# EAGLE design rgb-rotary-encoder-breakout-mk-1.0 (EAGLE 6.5.0)
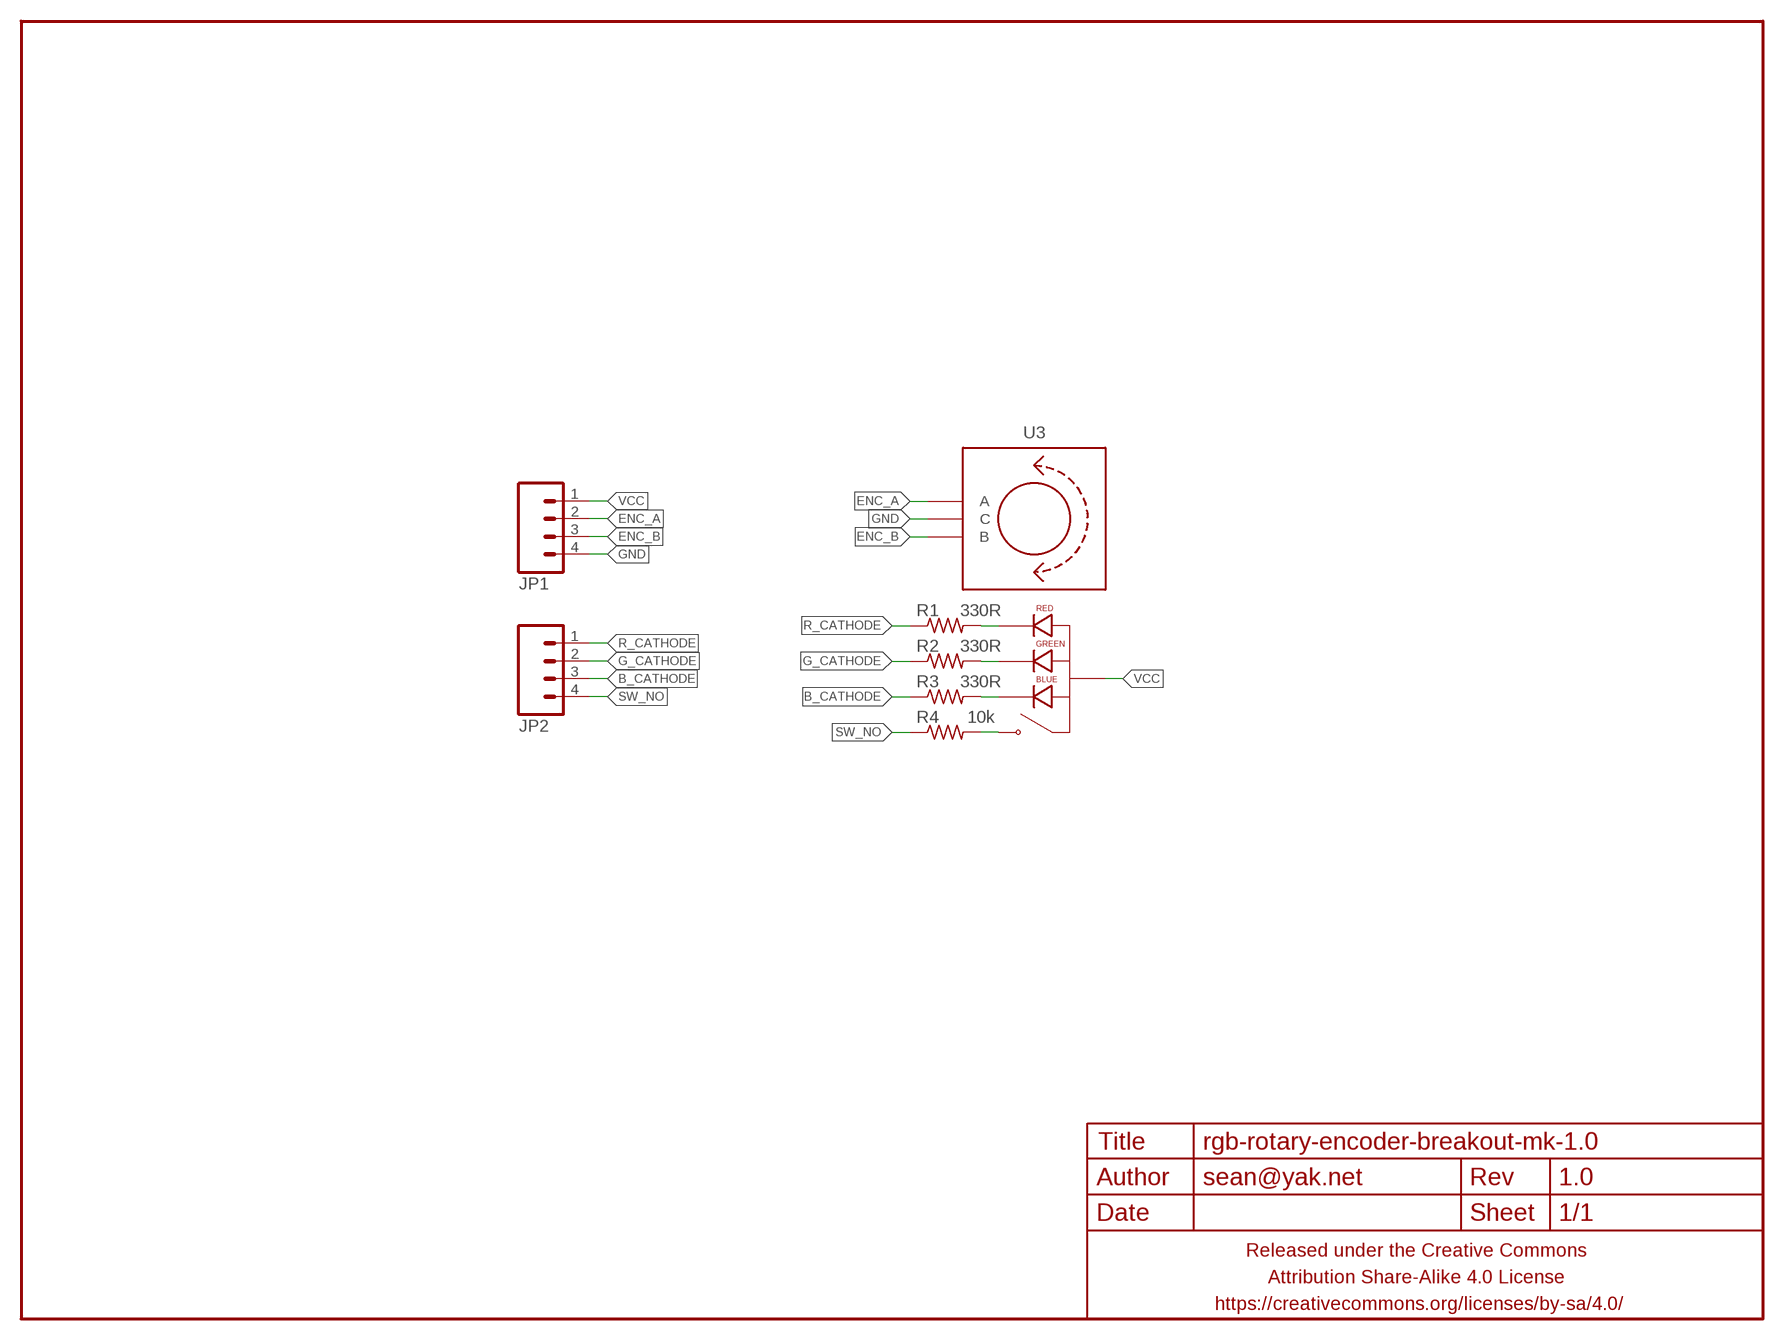
[diagram p0: schematic, sheet 1]

## Parts
FRAME1  FRAME-LETTERNO_PACKAGE  [DUMMY]
JP1  M04PTH  [1X04-PTH-VERT]
JP2  M04PTH  [1X04-PTH-VERT]
R1  330R  RESISTORPTH-AXIAL-7.62MM  [RESISTOR-AXIAL-PTH-7.62MM]
R2  330R  RESISTORPTH-AXIAL-7.62MM  [RESISTOR-AXIAL-PTH-7.62MM]
R3  330R  RESISTORPTH-AXIAL-7.62MM  [RESISTOR-AXIAL-PTH-7.62MM]
R4  10k  RESISTORPTH-AXIAL-7.62MM  [RESISTOR-AXIAL-PTH-7.62MM]
U3  ROTARY_ENCODER_SWITCH_RGBNO_LAB_TOP  [ROTARY_ENCODER_SWITCH_RGB_NO_LAB_TOP]

## Nets
B_CATHODE: JP2.3 R3.P$1
ENC_A: JP1.2 U3.ENC_A(A)
ENC_B: JP1.3 U3.ENC_B(B)
G_CATHODE: JP2.2 R2.P$1
GND: JP1.4 U3.ENC_COM(C)
N$1: R4.P$2 U3.SW_NO(NO)
N$2: R1.P$2 U3.LED_R(RED_CATHODE)
N$3: R2.P$2 U3.LED_G(GREEN_CATHODE)
N$4: R3.P$2 U3.LED_B(BLUE_CATHODE)
R_CATHODE: JP2.1 R1.P$1
SW_NO: JP2.4 R4.P$1
VCC: JP1.1 U3.LED_SW_COM(ANODE)

## Library data of the parts
FRAME1 = A_butts:FRAME-LETTER: Schematic Frame Standard 8.5x11 US Letter frame; DESIGNER: sean@yak.net; VERSION: 1.0
JP1 JP2 = A_butts:M04: Header 4 Standard 4-pin 0.1" header. Use with straight break away headers (SKU : PRT-00116), right angle break away headers (PRT-00553), swiss pins (PRT-00743), machine pins (PRT-00117), and female headers (PRT-00115). Molex polarized connector foot print use with SKU : PRT-08231 with associated crimp pins and housings. 1MM SMD Version SKU: PRT-10208
R1-R4 = A_butts:RESISTOR: RESISTOR, American symbol
U3 = A_butts:ROTARY_ENCODER_SWITCH_RGB

## Board
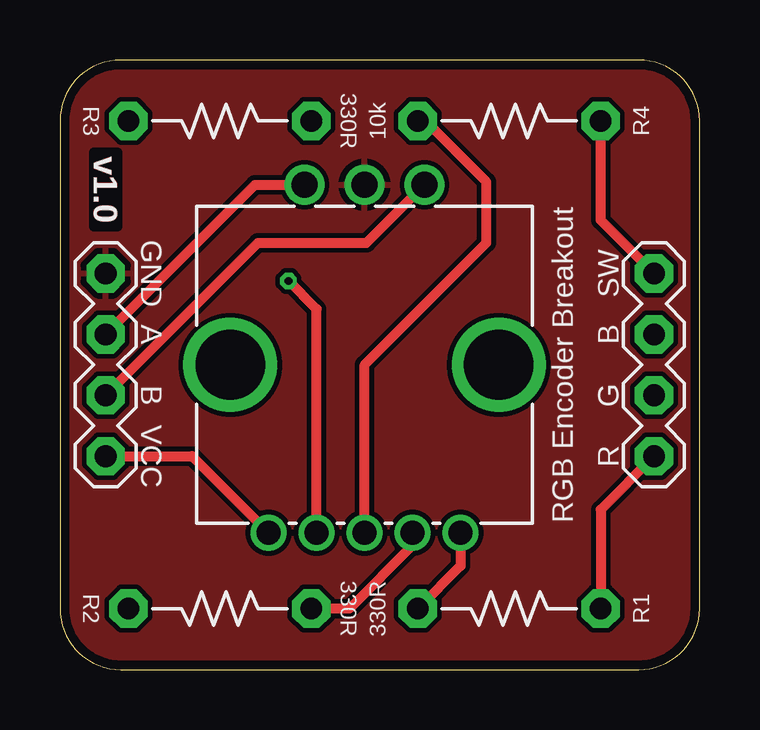
[diagram p1: board, top side]
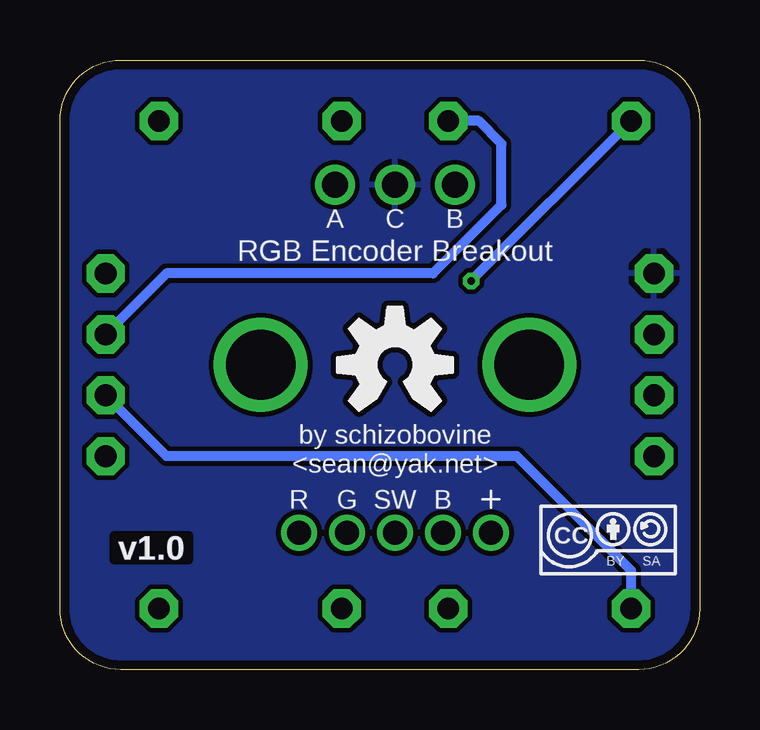
[diagram p2: board, bottom side, seen from below]

Size 26.67 x 25.4 mm. Coordinates in mm from the lower left corner, seen from the top.
Outline: 0,22.86 0,2.54 arc90 2.54,0 24.13,0 arc90 26.67,2.54 26.67,22.86 arc90 24.13,25.4 2.54,25.4 arc90 0,22.86
Copper layers (1*16): Top 0.0356mm / dielectric 1.5011mm / Bottom 0.0356mm
Design rules "LaenPCBOrder2": minimum track width 6mil, minimum drill 13mil, track to track 6mil, track to pad 6mil, pad to pad 6mil, via to via 6mil, smd to smd 6mil, copper to edge 15mil, drill to drill 6mil, minimum pad ring 7mil, minimum via ring 7mil, stop-mask expansion 3mil, vias tented up to drill 20mil, thermal gap 10mil

### Footprints (pad centres in the part's own frame; a part is rotated, then mirrored left to right if it is on the bottom)
1X04-PTH-VERT = drill 0.9 pad 1.6 octagon: 1 0,0; 2 2.54,0; 3 5.08,0; 4 7.62,0
RESISTOR-AXIAL-PTH-7.62MM = drill 0.9 pad 1.6 octagon: P$1 -3.81,0; P$2 3.81,0
ROTARY_ENCODER_SWITCH_RGB_NO_LAB_TOP = drill 1.1: ENC_A -2.5,-7.5; ENC_B 2.5,-7.5; ENC_COM 0,-7.5 | drill 1: LED_B 2,7; LED_G -2,7; LED_R -4,7; LED_SW_COM 4,7; SW_NO 0,7 | drill 2.9: P$1 -5.6,0; P$2 5.6,0

### Placement (x,y rotation side)
FRAME1  0,0 0 top
JP1  1.91,8.89 90 top
JP2  24.77,8.89 90 top
R1  18.73,2.54 180 top
R2  6.67,2.54 0 top
R3  6.67,22.86 180 top
R4  18.73,22.86 180 top
U3  12.7,12.7 180 top
U$1  [OSHWLOGO_5MM_METAL]  12.7,12.7 0 bottom
U$2  [CC-BY-SA-4.0-NO-URL]  3.81,5.4 0 bottom

### Tracks (layer width: path | path; a pad name or v marks a point on that pad's centre or on a via)
B_CATHODE
  Bottom 0.406: JP2.3 22.23,16.51 11.11,16.51 8.26,19.37 8.26,21.91 9.21,22.86 R3.P$1
ENC_A
  Top 0.406: JP1.2 8.26,17.78 12.78,17.78 U3.ENC_A
ENC_B
  Top 0.406: JP1.3 8.13,20.2 U3.ENC_B
G_CATHODE
  Bottom 0.406: R2.P$1 2.86,4.13 7.62,8.89 22.23,8.89 JP2.2
GND
  pour Bottom (isolate 0.2): 24.13,0 2.54,0 arc-90 0,2.54 0,22.86 arc-90 2.54,25.4 24.13,25.4 arc-90 26.67,22.86 26.67,2.54 arc-90
  pour Top (isolate 0.2): 24.13,0 2.54,0 arc-90 0,2.54 0,22.86 arc-90 2.54,25.4 24.13,25.4 arc-90 26.67,22.86 26.67,2.54 arc-90
N$1
  Top 0.406: U3.SW_NO 12.7,12.7 17.78,17.78 17.78,20.32 15.24,22.86 R4.P$2
N$2
  Top 0.406: U3.LED_R 16.7,4.32 R1.P$2
N$3
  Top 0.406: U3.LED_G 14.7,5.17 12.06,2.54 R2.P$2
N$4  (via drill 0.33)
  Top 0.406: U3.LED_B 10.7,15.02 v9.53,16.19
  Bottom 0.406: v9.53,16.19 R3.P$2
R_CATHODE
  Top 0.406: JP2.1 22.54,6.67 R1.P$1
SW_NO
  Top 0.406: JP2.4 22.54,18.73 R4.P$1
VCC
  Top 0.406: JP1.1 5.51,8.89 U3.LED_SW_COM

### Text on the board
tPlace: GND | SW | A | B | RGB Encoder Breakout | B | G | VCC | R
bPlace: RGB Encoder Breakout | by schizobovine / <sean@yak.net>